# EasyEDA Pro project Ultrasound_TX_44kHz_ESP32.eprj

# Schematic TX_Main
Create Date: 2025-08-09; Page Name: P1; Project Name: Ultrasound_TX_44kHz_ESP32; Schematic Name: TX_Main; Update Date: 2025-08-14; Company: EasyEDA.com; Page Size: A4; Version: V1.0
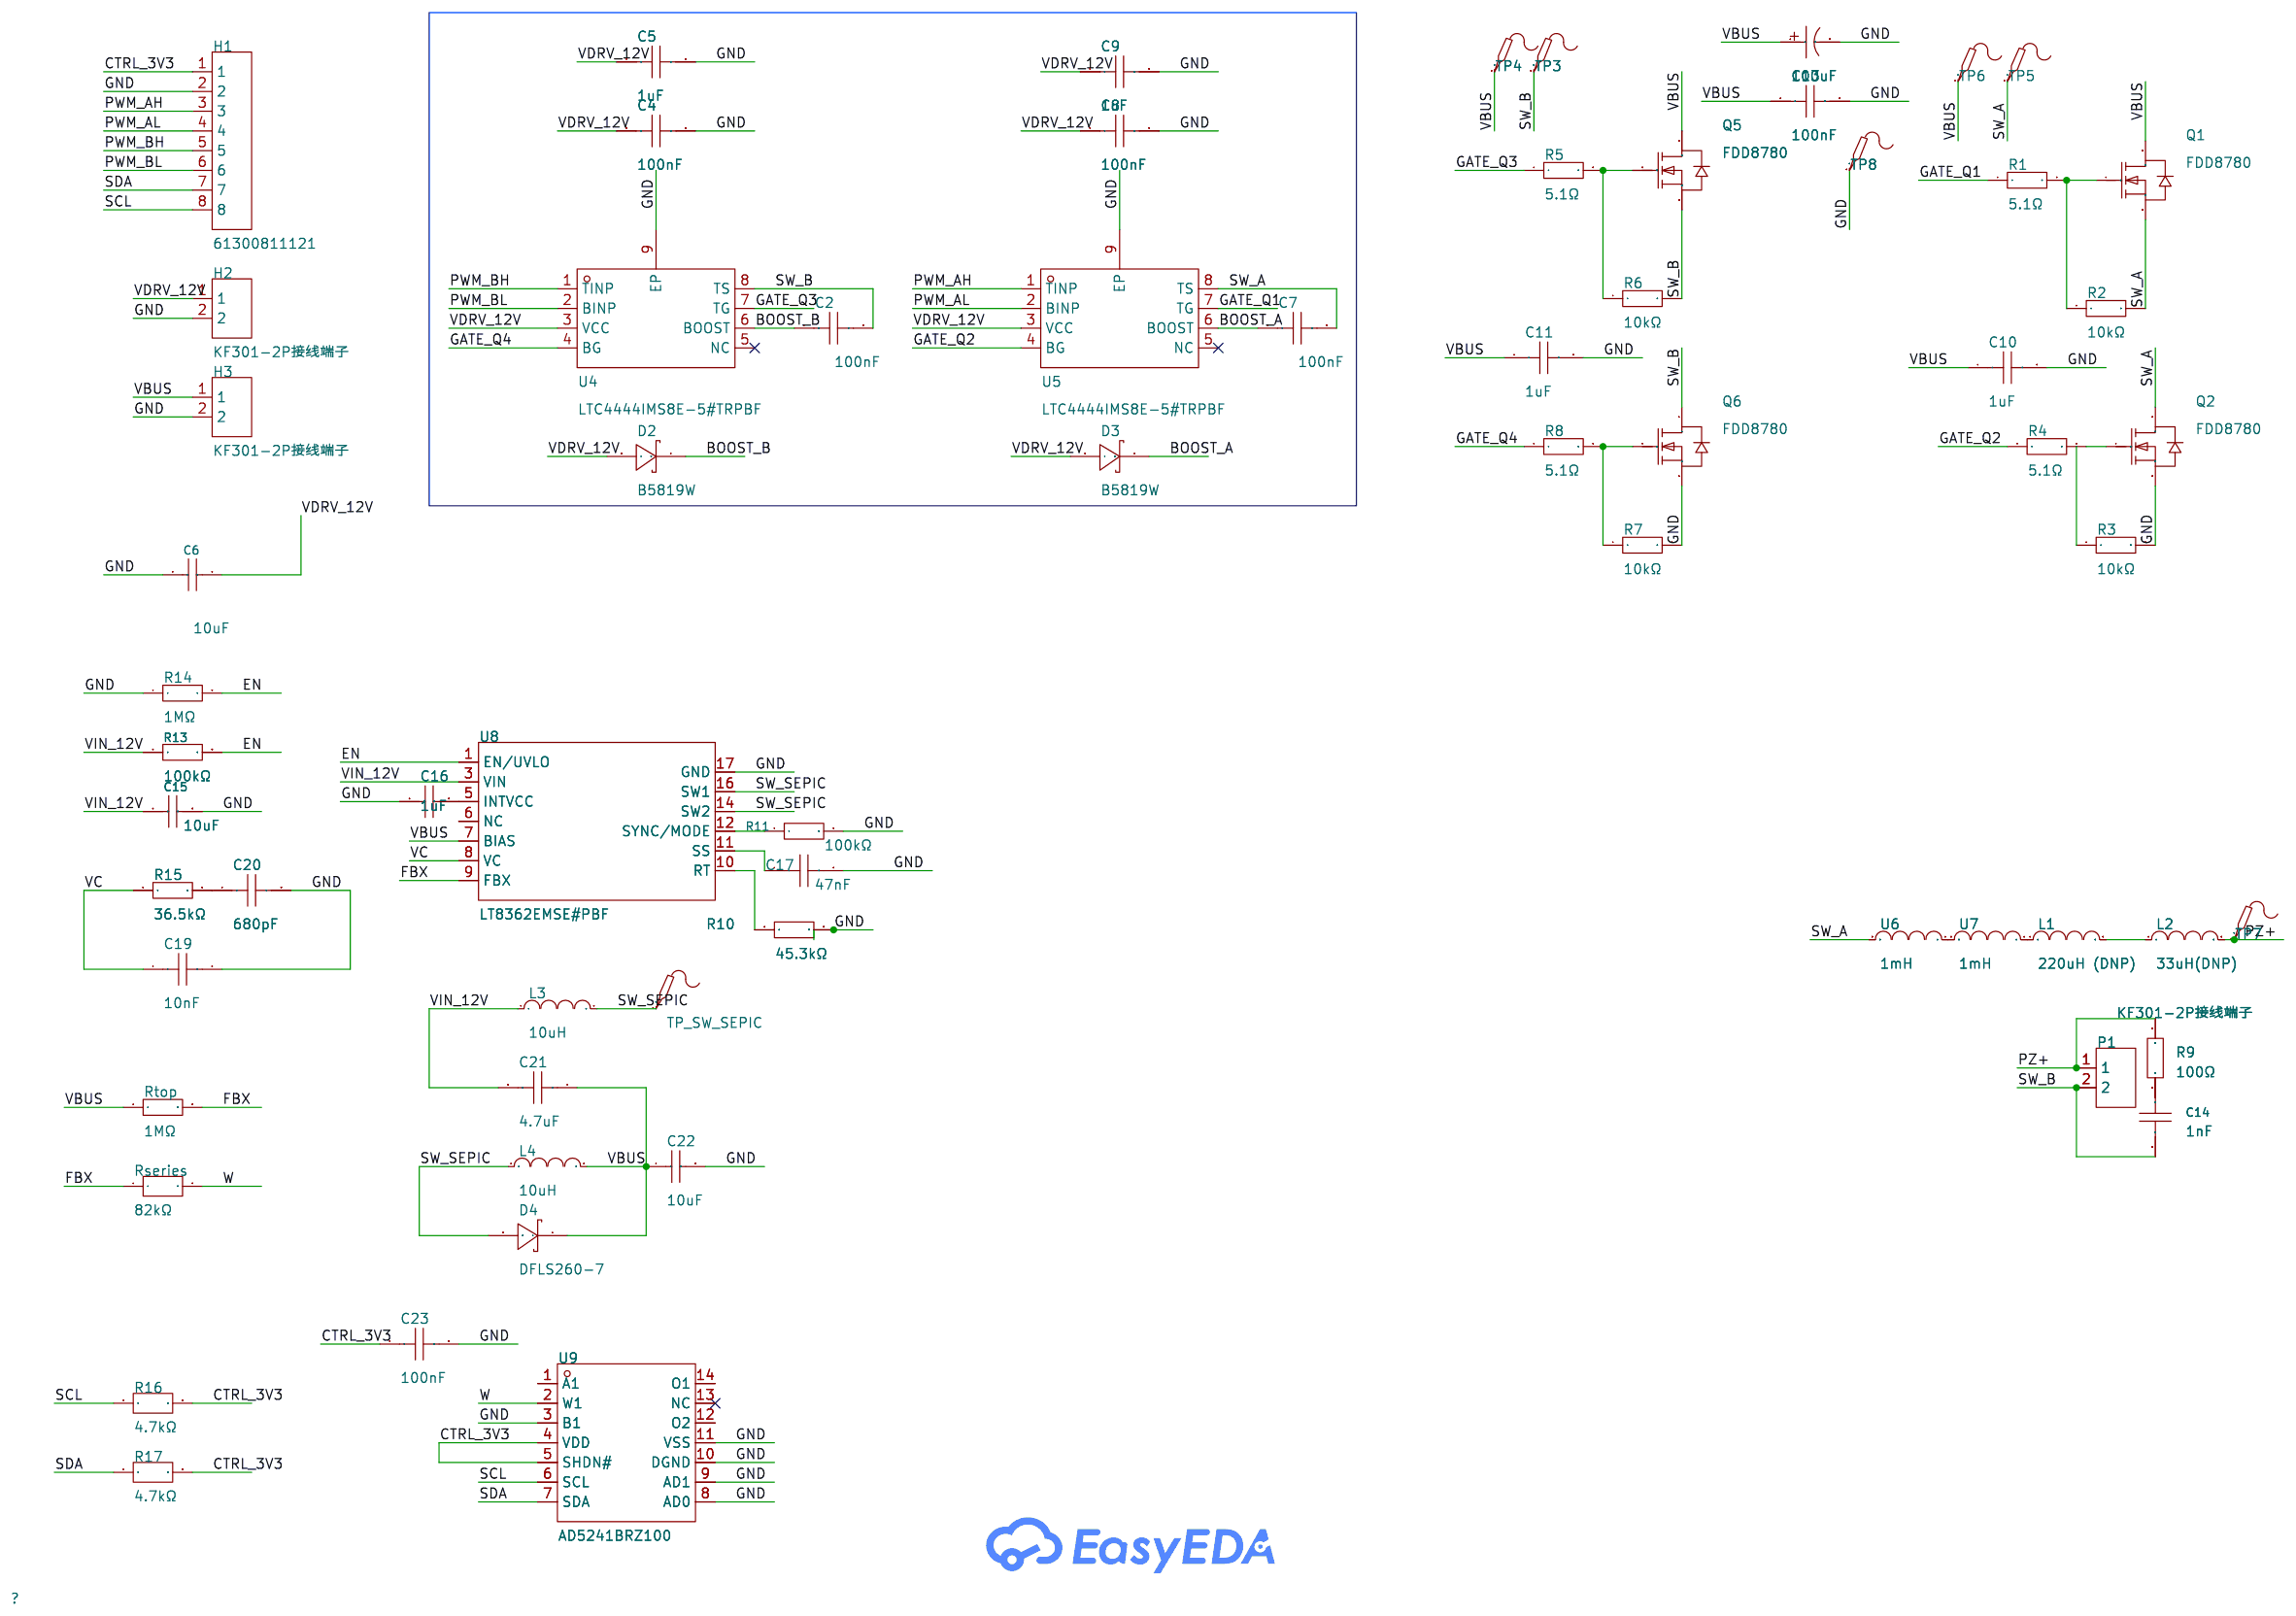
[diagram p0: schematic sheet]

## Parts
C2  100nF  [C0603]
C4  100nF  [C0603]
C5  1uF  [C0603]
C6  10uF  [C1206]
C7  100nF  [C0603]
C8  100nF  [C0603]
C9  1uF  [C0603]
C10  1uF  [C0603]
C11  1uF  [C0603]
C12  100uF  [CAP-SMD_BD8.0-L8.3-W8.3-FD]
C13  100nF  [C0603]
C14  1nF  [C0603]  (no BOM)
C15  10uF  [C1206]
C16  1uF  [C0603]
C17  47nF  [C0603]
C19  10nF  [C0603]
C20  680pF  [C0603]
C21  4.7uF  [C1210]
C22  10uF  [C1206]
C23  100nF  [C0603]
D2  B5819W  [SOD-123_L2.8-W1.8-LS3.7-RD]
D3  B5819W  [SOD-123_L2.8-W1.8-LS3.7-RD]
D4  DFLS260-7  [POWERDI-123_L2.8-W1.8-LS3.7-RD-1]
H1  61300811121  [HDR-TH_8P-P2.54-V-M]
H2  KF301-2P接线端子  [CONN-TH_XY301V-A-5.0-2P]
H3  KF301-2P接线端子  [CONN-TH_XY301V-A-5.0-2P]
L1  220uH (DNP)  [IND-SMD_L12.5-W12.5]
L2  33uH(DNP)  [IND-SMD_L12.5-W12.5]
L3  10uH  [IND-SMD_L12.0-W12.0]
L4  10uH  [IND-SMD_L12.0-W12.0]
P1  KF301-2P接线端子  [CONN-TH_XY301V-A-5.0-2P]
Q1  FDD8780  [TO-252-3_L6.5-W6.1-P4.58-LS10.0-TL]
Q2  FDD8780  [TO-252-3_L6.5-W6.1-P4.58-LS10.0-TL]
Q5  FDD8780  [TO-252-3_L6.5-W6.1-P4.58-LS10.0-TL]
Q6  FDD8780  [TO-252-3_L6.5-W6.1-P4.58-LS10.0-TL]
R1  5.1Ω  [R0603]
R2  10kΩ  [R0603]
R3  10kΩ  [R0603]
R4  5.1Ω  [R0603]
R5  5.1Ω  [R0603]
R6  10kΩ  [R0603]
R7  10kΩ  [R0603]
R8  5.1Ω  [R0603]
R9  100Ω  [R1206]  (no BOM)
R10  45.3kΩ  [R0603]
R11  100kΩ  [R0603]
R13  100kΩ  [R0603]
R14  1MΩ  [R0603]
R15  36.5kΩ  [R0603]
R16  4.7kΩ  [R0603]
R17  4.7kΩ  [R0603]
Rseries  82kΩ  [R0603]
Rtop  1MΩ  [R0603]
TP3  -  [Test-Point-0.5mm]
TP4  -  [Test-Point-0.5mm]
TP5  -  [Test-Point-0.5mm]
TP6  -  [Test-Point-0.5mm]
TP7  -  [Test-Point-0.5mm]
TP8  -  [Test-Point-0.5mm]
TP_SW_SEPIC  -  [Test-Point-0.5mm]
U4  LTC4444IMS8E-5#TRPBF  [MSOP-8_L3.0-W3.0-P0.65-LS5.0-BL-EP]
U5  LTC4444IMS8E-5#TRPBF  [MSOP-8_L3.0-W3.0-P0.65-LS5.0-BL-EP]
U6  1mH  [IND-SMD_L12.5-W12.5]
U7  1mH  [IND-SMD_L12.5-W12.5]
U8  LT8362EMSE#PBF  [MSOP-16_12P-L4.0-W3.0-P0.50-LS4.9-BL-EP]
U9  AD5241BRZ100  [SOIC-14_L8.7-W3.9-P1.27-LS6.0-BL]

## Library data of the parts
C2 C4 C7 C8 C13 C23 = GRM188R71H104KA93D: LCSC Part Name: 100nF ±10% 50V; Supplier Part: C77055; Manufacturer: muRata(村田); Supplier Footprint: 0603; JLCPCB Part Class: Extended Part; Datasheet: https://atta.szlcsc.com/upload/public/pdf/source/20200305/C490387_23319AE8C154DEB24C505E6C82A8106A.pdf; Supplier: LCSC; Tolerance: ±10%; Voltage Rating: 50V; Temperature Coefficient: X7R
C5 C9 = GRM188R61H105KAALD: LCSC Part Name: 1uF ±10% 50V; Supplier Part: C77386; Manufacturer: muRata(村田); Supplier Footprint: 0603; JLCPCB Part Class: Extended Part; Datasheet: https://atta.szlcsc.com/upload/public/pdf/source/20170116/1484561238855.pdf; Supplier: LCSC; Tolerance: ±10%
C6 C15 = GRM31CR71E106KA12L: LCSC Part Name: 10uF ±10% 25V; Supplier Part: C77093; Manufacturer: muRata(村田); Supplier Footprint: 1206; JLCPCB Part Class: Extended Part; Datasheet: https://atta.szlcsc.com/upload/public/pdf/source/20200305/C490387_23319AE8C154DEB24C505E6C82A8106A.pdf; Supplier: LCSC; Tolerance: ±10%
C10 C11 = CL10A105KB8NNNC: LCSC Part Name: 1uF ±10% 50V; Supplier Part: C15849; Manufacturer: SAMSUNG(三星); Supplier Footprint: 0603; JLCPCB Part Class: Basic Part; Datasheet: https://item.szlcsc.com/datasheet/CL10A105KB8NNNC/16531.html; Supplier: LCSC; Tolerance: ±10%; Voltage Rating: 50V; Temperature Coefficient: X5R
C12 = UUD1H101MNL1GS: LCSC Part Name: 100uF ±20% 50V; Supplier Part: C116241; Manufacturer: Nichicon(尼吉康); Supplier Footprint: SMD,D8xL10mm; JLCPCB Part Class: Extended Part; Datasheet: https://atta.szlcsc.com/upload/public/pdf/source/20180326/C125983_56B177A233E9C87488B5B9821933DC08.pdf; Supplier: LCSC; Tolerance: ±20%; Voltage Rating: 50V; Ripple Current: 150mA@120Hz; Diameter: 8mm; Height - Seated (Max): 10.5mm; Lifetime: 5000hrs@105℃; Operating Temperature: -55℃~+105℃
C14 = GRM1885C2A102JA01D: LCSC Part Name: 1nF ±5% 100V; Supplier Part: C162257; Manufacturer: muRata(村田); Supplier Footprint: 0603; JLCPCB Part Class: Extended Part; Datasheet: https://atta.szlcsc.com/upload/public/pdf/source/20190531/C162257_10DFEB7E08AF7582EA5EAC372162EEAC.pdf; Supplier: LCSC; Tolerance: ±5%
C16 = GRM188R71A105KA61D: LCSC Part Name: 1uF ±10% 10V; Supplier Part: C97888; Manufacturer: muRata(村田); Supplier Footprint: 0603; JLCPCB Part Class: Extended Part; Datasheet: https://atta.szlcsc.com/upload/public/pdf/source/20180228/C97888_15198056439981377653.pdf; Supplier: LCSC; Tolerance: ±10%
C17 = GRM188R71H473KA61D: LCSC Part Name: 47nF ±10% 50V; Supplier Part: C86027; Manufacturer: muRata(村田); Supplier Footprint: 0603; JLCPCB Part Class: Extended Part; Datasheet: https://atta.szlcsc.com/upload/public/pdf/source/20200305/C490387_23319AE8C154DEB24C505E6C82A8106A.pdf; Supplier: LCSC; Tolerance: ±10%
C19 = GRM188R71H103KA01J: LCSC Part Name: 10nF ±10% 50V; Supplier Part: C470844; Manufacturer: muRata(村田); Supplier Footprint: 0603; JLCPCB Part Class: Extended Part; Datasheet: https://atta.szlcsc.com/upload/public/pdf/source/20191217/C470851_D5950D7996CF95F2404F5A95832067FE.pdf; Supplier: LCSC; Tolerance: ±10%
C20 = GRM1885C1H681JA01D: LCSC Part Name: 680pF ±5% 50V; Supplier Part: C97882; Manufacturer: muRata(村田); Supplier Footprint: 0603; Datasheet: https://atta.szlcsc.com/upload/public/pdf/source/20180228/C97882_15198056396001377648.pdf; Supplier: LCSC; Tolerance: ±5%
C21 = C3225X7R1H475K250AB: LCSC Part Name: 4.7uF ±10% 50V; Supplier Part: C2183952; Manufacturer: TDK; Supplier Footprint: 1210; JLCPCB Part Class: Extended Part; Datasheet: https://atta.szlcsc.com/upload/public/pdf/source/20210430/12912E3792F621391F28022904E5A4A4.pdf; Supplier: LCSC; Tolerance: ±10%
C22 = CL31A106KBHNNNE: LCSC Part Name: 10uF ±10% 50V; Supplier Part: C13585; Manufacturer: SAMSUNG(三星); Supplier Footprint: 1206; Datasheet: https://item.szlcsc.com/datasheet/CL31A106KBHNNNE/14236.html; Supplier: LCSC; Tolerance: ±10%; Voltage Rating: 50V; Temperature Coefficient: X5R
D2 D3 = B5819W_C397172: LCSC Part Name: 电压:40V 电流:1A; Supplier Part: C397172; Manufacturer: FMS(美丽微); Supplier Footprint: SOD-123; JLCPCB Part Class: Extended Part; Datasheet: https://atta.szlcsc.com/upload/public/pdf/source/20190730/C397172_38105B7093BBAB0D9F9B3C5156B7AB02.pdf; Supplier: LCSC; Forward Voltage (Vf@If): 600mV@1A; Reverse Voltage (Vr): 40V; Average Rectified Current (Io): 1A
D4 = DFLS260-7: LCSC Part Name: 电压:60V 电流:2A; Supplier Part: C209346; Manufacturer: DIODES(美台); Supplier Footprint: Power-DI-123; JLCPCB Part Class: Extended Part; Datasheet: https://atta.szlcsc.com/upload/public/pdf/source/20180329/C209346_DD3E4386DCF8B714CD1975D0001742B7.pdf; Supplier: LCSC; Forward Voltage (Vf@If): 560mV@2A; Reverse Voltage (Vr): 60V; Rectified Current: 2A
H1 = 61300811121: LCSC Part Name: 间距:2.54mm 直插; Supplier Part: C6400764; Manufacturer: Wurth(伍尔特); Supplier Footprint: 插件,P=2.54mm; JLCPCB Part Class: Extended Part; Datasheet: https://www.we-online.com/components/products/datasheet/61300811121.pdf; Supplier: LCSC; Pitch: 2.54mm; Mounting Type: Straight; Number of Rows: Single Row; Number of Pins: 8P; Current Rating: 3A; Voltage Rating (Max): 250V; Contact Material: Copper alloy; Operating Temperature: -40℃~+105℃; Color: Black
H2 H3 P1 = KF301-2P接线端子: Supplier Part: C9900016950; Supplier Footprint: CK301-2P; JLCPCB Part Class: Extended Part; Supplier: LCSC
L1 = SWRB1207S-221MT: LCSC Part Name: 220uH ±20%; Supplier Part: C169380; Manufacturer: Sunlord(顺络); Supplier Footprint: SMD; JLCPCB Part Class: Extended Part; Datasheet: https://atta.szlcsc.com/upload/public/pdf/source/20231024/92A2326C853CCAB66AAE5F7AA05D2DF0.pdf; Supplier: LCSC; Tolerance: ±20%
L2 = SWRB1207S-330MT: LCSC Part Name: 33uH ±20%; Supplier Part: C169375; Manufacturer: Sunlord(顺络); Supplier Footprint: SMD,12.5x12.5mm; JLCPCB Part Class: Extended Part; Datasheet: https://atta.szlcsc.com/upload/public/pdf/source/20241120/27810B405253B06C26B15E37EF475A63.pdf; Supplier: LCSC; Tolerance: ±20%
L3 L4 = SWRB1207S-100MT: LCSC Part Name: 10uH ±20%; Supplier Part: C56593; Manufacturer: Sunlord(顺络); Supplier Footprint: SMD,12.5x12.5mm; Datasheet: https://atta.szlcsc.com/upload/public/pdf/source/20241120/27810B405253B06C26B15E37EF475A63.pdf; Supplier: LCSC; Tolerance: ±20%
Q1 Q2 Q5 Q6 = FDD8780: LCSC Part Name: 1个N沟道 耐压:25V 电流:35A; Supplier Part: C241787; Manufacturer: onsemi(安森美); Supplier Footprint: TO-252; JLCPCB Part Class: Extended Part; Datasheet: https://atta.szlcsc.com/upload/public/pdf/source/20230915/415CA15EE412DCE977B57DFCF441E13A.pdf; Supplier: LCSC; Type: 1 N-Channel; Drain Source On Resistance (RDS(on)@Vgs,Id): 8.5mΩ@10V,35A; Total Gate Charge (Qg@Vgs): 29nC@10V; Input Capacitance (Ciss@Vds): 1.44nF@13V; Operating Temperature: -55℃~+175℃@(Tj)
R1 R4 R5 R8 = RC0603FR-075R1L: LCSC Part Name: 厚膜电阻 5.1Ω ±1% 100mW; Supplier Part: C114626; Manufacturer: YAGEO(国巨); Supplier Footprint: 0603; JLCPCB Part Class: Extended Part; Datasheet: https://atta.szlcsc.com/upload/public/pdf/source/20180821/C275644_0D56F95EFF785E7D9A1FEF436B37DA78.pdf; Supplier: LCSC; Type: Thick Film Resistors; Tolerance: ±1%; Temperature Coefficient: ±200ppm/℃; Operating Temperature Range: -55℃~+155℃
R2 R3 R6 R7 = RC0603FR-0710KL: LCSC Part Name: 厚膜电阻 10kΩ ±1% 100mW; Supplier Part: C98220; Manufacturer: YAGEO(国巨); Supplier Footprint: 0603; JLCPCB Part Class: Extended Part; Datasheet: https://atta.szlcsc.com/upload/public/pdf/source/20180927/C295883_E8D83085EA81BD7DE0B2B681138C15EE.pdf; Supplier: LCSC; Type: Thick Film Resistors; Tolerance: ±1%; Temperature Coefficient: ±100ppm/℃; Operating Temperature Range: -55℃~+155℃
R9 = RC1206FR-07100RL: LCSC Part Name: 厚膜电阻 100Ω ±1% 250mW; Supplier Part: C137392; Manufacturer: YAGEO(国巨); Supplier Footprint: 1206; JLCPCB Part Class: Extended Part; Datasheet: https://atta.szlcsc.com/upload/public/pdf/source/20180821/C275644_0D56F95EFF785E7D9A1FEF436B37DA78.pdf; Supplier: LCSC; Type: Thick Film Resistors; Tolerance: ±1%; Power(Watts): 250mW; Temperature Coefficient: ±100ppm/℃; Operating Temperature Range: -55℃~+155℃
R10 = RC0603FR-0745K3L: LCSC Part Name: 厚膜电阻 45.3kΩ ±1% 100mW; Supplier Part: C245971; Manufacturer: YAGEO(国巨); Supplier Footprint: 0603; Datasheet: https://atta.szlcsc.com/upload/public/pdf/source/20181031/C326976_E9901E35333D136A19B6CE377E889A82.pdf; Supplier: LCSC; Type: Thick Film Resistors; Tolerance: ±1%; Temperature Coefficient: ±100ppm/℃; Operating Temperature Range: -55℃~+155℃
R11 R13 = RC0603FR-07100KL: LCSC Part Name: 厚膜电阻 100kΩ ±1% 100mW; Supplier Part: C14675; Manufacturer: YAGEO(国巨); Supplier Footprint: 0603; Datasheet: https://atta.szlcsc.com/upload/public/pdf/source/20140324/1457707028752.pdf; Supplier: LCSC; Type: Thick Film Resistors; Tolerance: ±1%; Temperature Coefficient: ±100ppm/℃; Operating Temperature Range: -55℃~+155℃
R14 Rtop = RC0603FR-071ML: LCSC Part Name: 厚膜电阻 1MΩ ±1% 100mW; Supplier Part: C105578; Manufacturer: YAGEO(国巨); Supplier Footprint: 0603; Datasheet: https://atta.szlcsc.com/upload/public/pdf/source/20181102/C105578_67A9388250AF143DE4682E62257D2969.pdf; Supplier: LCSC; Type: Thick Film Resistors; Tolerance: ±1%; Temperature Coefficient: ±100ppm/℃; Operating Temperature Range: -55℃~+155℃
R15 = RC0603FR-0736K5L: LCSC Part Name: 厚膜电阻 36.5kΩ ±1% 100mW; Supplier Part: C137738; Manufacturer: YAGEO(国巨); Supplier Footprint: 0603; JLCPCB Part Class: Extended Part; Datasheet: https://atta.szlcsc.com/upload/public/pdf/source/20180821/C275644_0D56F95EFF785E7D9A1FEF436B37DA78.pdf; Supplier: LCSC; Type: Thick Film Resistors; Tolerance: ±1%; Temperature Coefficient: ±100ppm/℃; Operating Temperature Range: -55℃~+155℃
R16 R17 = CRCW06034K70FKEA: LCSC Part Name: 厚膜电阻 4.7kΩ ±1% 100mW; Supplier Part: C844931; Manufacturer: VISHAY(威世); Supplier Footprint: 0603; JLCPCB Part Class: Extended Part; Datasheet: https://atta.szlcsc.com/upload/public/pdf/source/20200922/C242478_0C7172CD6F5C3D507069694ED76193BB.pdf; Supplier: LCSC; Type: Thick Film Resistor; Tolerance: ±1%; Power(Watts): 100mW; Voltage-Supply(Max): 75V; Temperature Coefficient: ±100ppm/℃; Operating Temperature: -55℃~+155℃
Rseries = CRCW060382K0FKEA: LCSC Part Name: 厚膜电阻 82kΩ ±1% 100mW; Supplier Part: C844589; Manufacturer: VISHAY(威世); Supplier Footprint: 0603; JLCPCB Part Class: Extended Part; Datasheet: https://atta.szlcsc.com/upload/public/pdf/source/20200927/C844045_6AA1A6DF5B555BABAEE9BB169E8C33AD.pdf; Supplier: LCSC; Type: Thick Film Resistors; Tolerance: ±1%; Power(Watts): 100mW; Voltage-Supply(Max): 100V; Temperature Coefficient: ±100ppm/℃; Operating Temperature: -55℃~+155℃
TP3-TP8 TP_SW_SEPIC = Test-Point
U4 U5 = LTC4444IMS8E-5#TRPBF: Supplier Part: C688585; Manufacturer: ADI(亚德诺); Supplier Footprint: MSOP-8-EP; JLCPCB Part Class: Extended Part; Datasheet: https://atta.szlcsc.com/upload/public/pdf/source/20200917/C688576_E701C804240436C61CA95C34F1FA05BF.pdf; Supplier: LCSC; Load Type: MOSFET; Number of Drivers: 2; Peak Output Current(sink): 1.75A; Peak Output Current(source): 1.4A; Supply Voltage: 4.5V~13.5V; Operating Temperature: -40℃~+125℃
U6 U7 = SRR1260A-102K: LCSC Part Name: 1mH ±10% 600mA; Supplier Part: C2047412; Manufacturer: BOURNS; Supplier Footprint: SMD,12.5x12.5mm; JLCPCB Part Class: Extended Part; Datasheet: https://atta.szlcsc.com/upload/public/pdf/source/20210428/65150C7414D3E7C87210BF4172587F8A.pdf; Supplier: LCSC; Tolerance: ±10%; Current - Saturation(Isat): 600mA; DC Resistance(DCR): 1.7Ω; Ratings: AEC-Q200
U8 = LT8362EMSE#PBF: LCSC Part Name: 具 2A、60V 开关的低 IQ 升压 / SEPIC / 负输出转换器; Supplier Part: C673763; Manufacturer: ADI(亚德诺); Supplier Footprint: MSOP-12; JLCPCB Part Class: Extended Part; Datasheet: https://item.szlcsc.com/datasheet/LT8362EMSE%2523PBF/704809.html; Supplier: LCSC; Function: Boost; Voltage - Supply: 2.8V~60V; Output Voltage: 60V; Output Current: 2A; Frequency - Switching: 2MHz; Operating Temperature: -40℃~+125℃@(TJ); Number of Outputs: 1; Topology: SEPIC；Boost；Inverting; Switch tube (built-in/external): Built-In
U9 = AD5241BRZ100: LCSC Part Name: I2C® 兼容型数字电位计; Supplier Part: C649387; Manufacturer: ADI(亚德诺); Supplier Footprint: SOIC-14; JLCPCB Part Class: Extended Part; Datasheet: https://item.szlcsc.com/datasheet/AD5241BRZ100/678996.html; Supplier: LCSC; Resistance Value (Ohms): 100kΩ; Number of Taps: 256; Number of Channels: 1; Tolerance: -30%~+50%; Voltage - Supply: 2.7V~5.5V; Interface: I2C; Temperature Coefficient(Typ): 30ppm/℃; Operating Temperature: -40℃~+105℃; Resistance value change: Linear; Bandwidth: 69kHz

## Nets
GND: C4.2 C5.2 C6.1 C8.2 C9.2 C10.2 C11.2 C12.2 C13.2 C15.2 C16.1 C17.2 C19.2 C20.2 C22.2 C23.2 H1.2 H2.2 H3.2 Q2.3(S) Q6.3(S) R3.2 R7.2 R10.2 R11.2 R14.1 TP8.1 U4.9(EP) U5.9(EP) U8.17(GND) U9.3(B1) U9.8(AD0) U9.9(AD1) U9.10(DGND) U9.11(VSS)
VBUS: C10.1 C11.1 C12.1 C13.1 C21.1 C22.1 D4.1 H3.1 L4.2 Q1.2(D) Q5.2(D) Rtop.1 TP4.1 TP6.1 U8.7(BIAS)
VIN_12V: C15.1 C21.2 L3.1 R13.1 U8.3(VIN)
BOOST_A: C7.1 D3.1(C) U5.6(BOOST)
BOOST_B: C2.1 D2.1(C) U4.6(BOOST)
CTRL_3V3: C23.1 H1.1 R16.2 R17.2 U9.4(VDD) U9.5(SHDN#)
EN: R13.2 R14.2 U8.1(EN/UVLO)
FBX: Rseries.1 Rtop.2 U8.9(FBX)
GATE_Q1: R1.1 U5.7(TG)
GATE_Q2: R4.1 U5.4(BG)
GATE_Q3: R5.1 U4.7(TG)
GATE_Q4: R8.1 U4.4(BG)
PWM_AH: H1.3 U5.1(TINP)
PWM_AL: H1.4 U5.2(BINP)
PWM_BH: H1.5 U4.1(TINP)
PWM_BL: H1.6 U4.2(BINP)
PZ+: L2.2 P1.1 R9.2 TP7.1
SCL: H1.8 R16.1 U9.6(SCL)
SDA: H1.7 R17.1 U9.7(SDA)
SW_A: C7.2 Q1.3(S) Q2.2(D) R2.2 TP5.1 U5.8(TS) U6.2
SW_B: C2.2 C14.2 P1.2 Q5.3(S) Q6.2(D) R6.2 TP3.1 U4.8(TS)
SW_SEPIC: D4.2 L3.2 L4.1 TP_SW_SEPIC.1 U8.14(SW2) U8.16(SW1)
VC: C19.1 R15.1 U8.8(VC)
VDRV_12V: C4.1 C5.1 C6.2 C8.1 C9.1 D2.2(A) D3.2(A) H2.1 U4.3(VCC) U5.3(VCC)
W: Rseries.2 U9.2(W1)
Net-(C14-1): C14.1 R9.1
Net-(C16-2): C16.2 U8.5(INTVCC)
Net-(C17-1): C17.1 U8.11(SS)
Net-(C20-1): C20.1 R15.2
Net-(L1-1): L1.1 U7.1
Net-(L1-2): L1.2 L2.1
Net-(Q1-1): Q1.1(G) R1.2 R2.1
Net-(Q2-1): Q2.1(G) R4.2
Net-(Q5-1): Q5.1(G) R5.2 R6.1
Net-(Q6-1): Q6.1(G) R7.1 R8.2
Net-(R10-1): R10.1 U8.10(RT)
Net-(R11-1): R11.1 U8.12(SYNC/MODE)
Net-(U6-1): U6.1 U7.2

Not connected (* = marked no-connect by the designer): R3 1; U4 5(NC)*; U5 5(NC)*; U8 6(NC); U9 1(A1) 12(O2) 13(NC)* 14(O1)
